# Altium project VCTS_mainboard.PrjPcb (part 1 of 2)
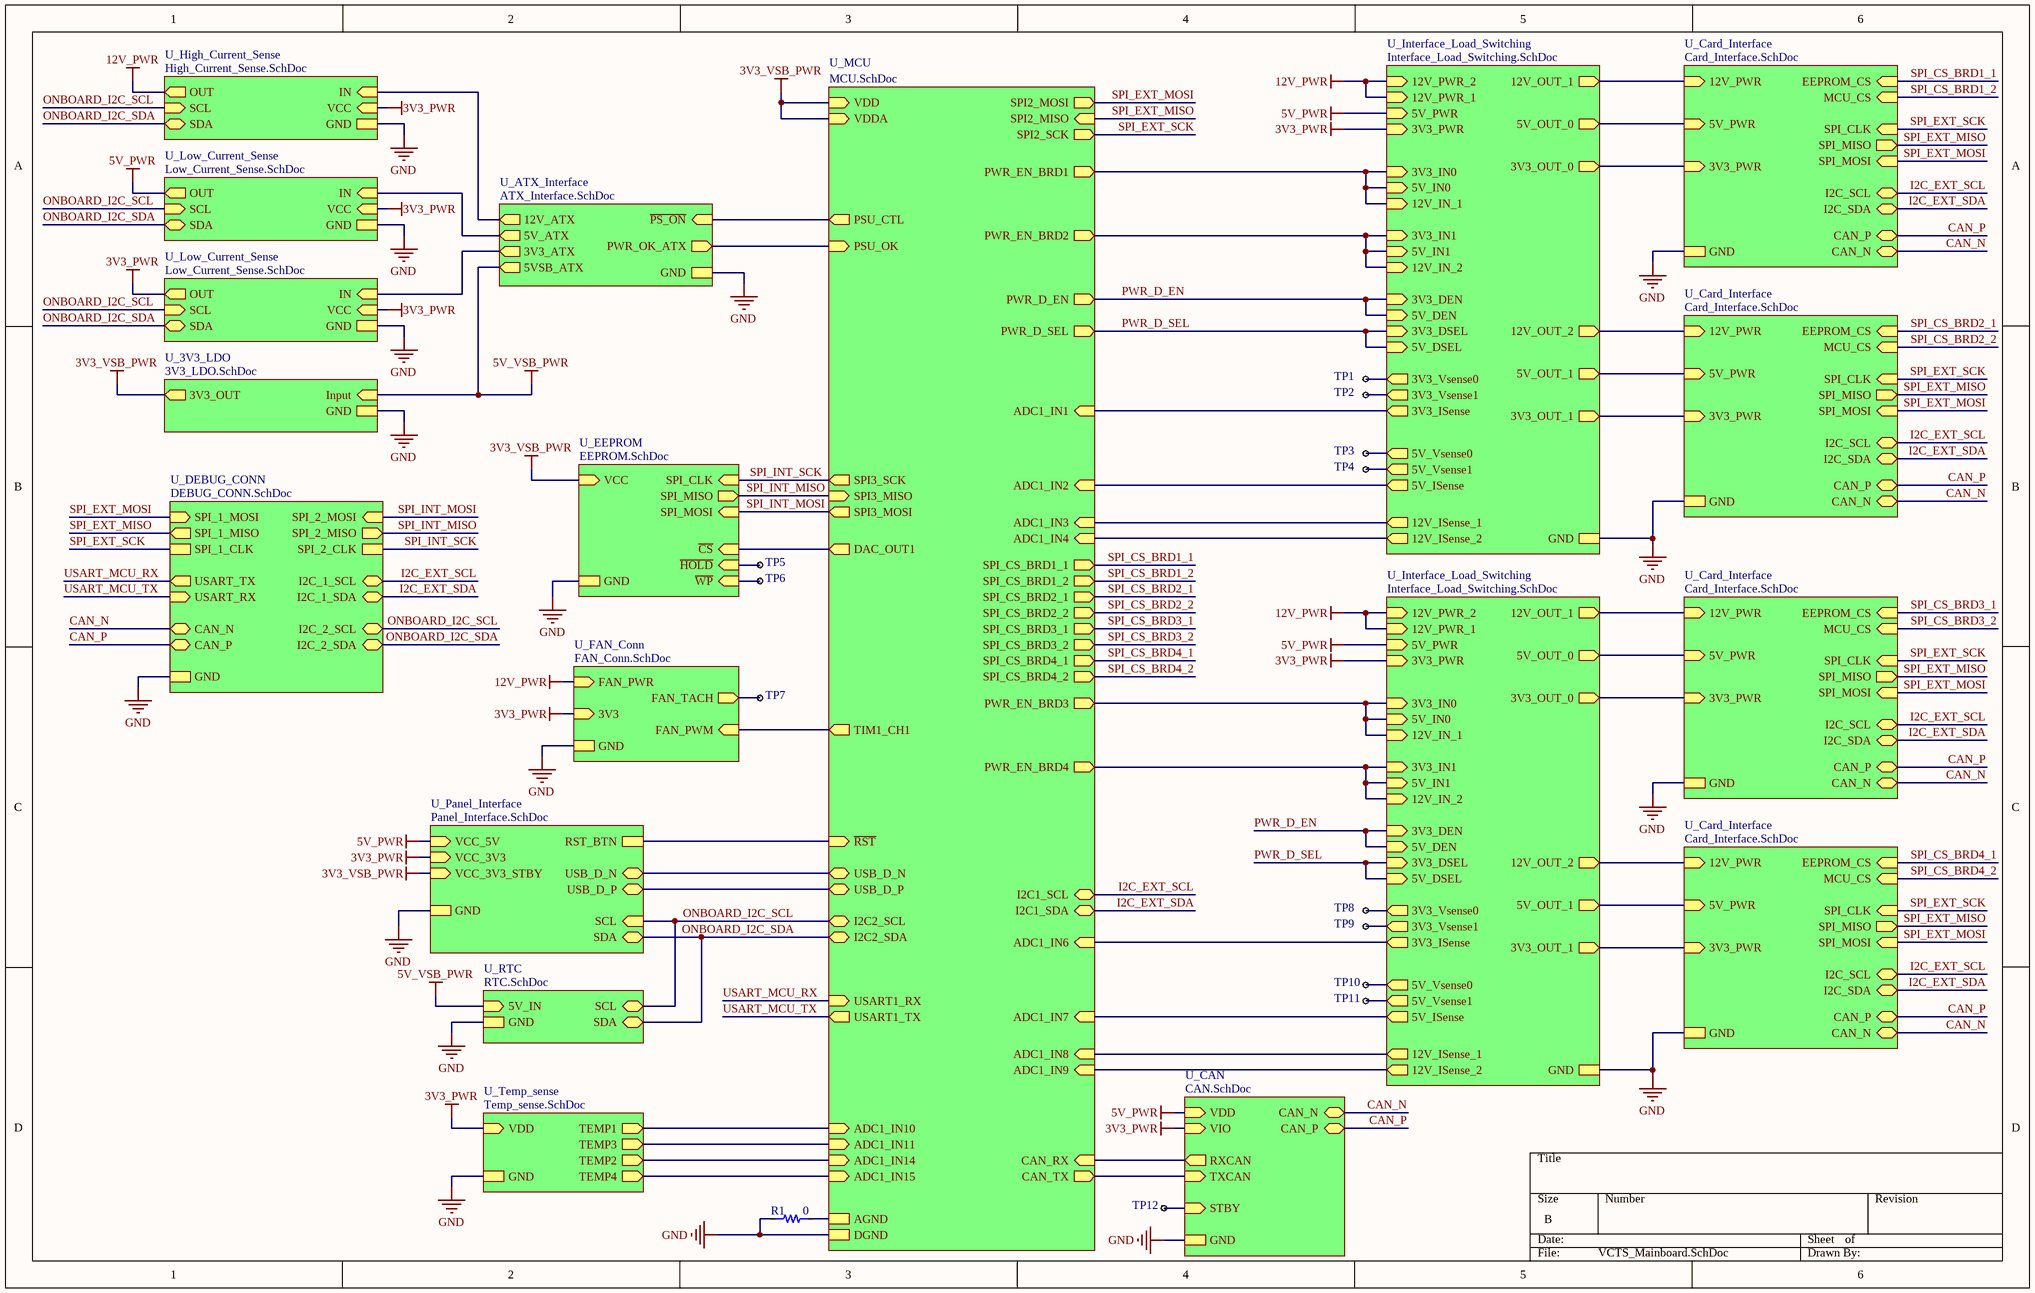
[diagram p0: VCTS_Mainboard.SchDoc]
16 sheets, 546 parts. Net scope: hierarchical (ports join the sheet entries above them; power ports are global).
Board file: VCTS_mainboard.PcbDoc
Sheets:
  VCTS_Mainboard.SchDoc
    U_MCU = MCU.SchDoc
    U_CAN = CAN.SchDoc
    U_RTC = RTC.SchDoc
    U_Temp_sense = Temp_sense.SchDoc
    U_High_Current_Sense = High_Current_Sense.SchDoc
    U_ATX_Interface = ATX_Interface.SchDoc
    U_EEPROM = EEPROM.SchDoc
    U_Card_Interface = Card_Interface.SchDoc
    U_Panel_Interface = Panel_Interface.SchDoc
      U_RGB_LED = RGB_LED.SchDoc
      U_RGB_LED = RGB_LED.SchDoc
      U_RGB_LED = RGB_LED.SchDoc
      U_RGB_LED = RGB_LED.SchDoc
      U_RGB_LED = RGB_LED.SchDoc
      U_RGB_LED = RGB_LED.SchDoc
      U_RGB_LED = RGB_LED.SchDoc
      U_RGB_LED = RGB_LED.SchDoc
    U_FAN_Conn = FAN_Conn.SchDoc
    U_Interface_Load_Switching = Interface_Load_Switching.SchDoc
    U_3V3_LDO = 3V3_LDO.SchDoc
    U_Low_Current_Sense = Low_Current_Sense.SchDoc
    U_Low_Current_Sense = Low_Current_Sense.SchDoc
    U_Card_Interface = Card_Interface.SchDoc
    U_Card_Interface = Card_Interface.SchDoc
    U_Interface_Load_Switching = Interface_Load_Switching.SchDoc
    U_Card_Interface = Card_Interface.SchDoc
    U_DEBUG_CONN = DEBUG_CONN.SchDoc

## Sheet VCTS_Mainboard.SchDoc
size B; SheetNumber: 1; SheetTotal: 16

### Parts
R1  value 0  [0603_RES]  (hidden comment: Resistor)
TP1  1mm Testpoint  [1mm_testpoint]  (value not drawn)
TP2  1mm Testpoint  [1mm_testpoint]  (value not drawn)
TP3  1mm Testpoint  [1mm_testpoint]  (value not drawn)
TP4  1mm Testpoint  [1mm_testpoint]  (value not drawn)
TP5  1mm Testpoint  [1mm_testpoint]  (value not drawn)
TP6  1mm Testpoint  [1mm_testpoint]  (value not drawn)
TP7  1mm Testpoint  [1mm_testpoint]  (value not drawn)
TP8  1mm Testpoint  [1mm_testpoint]  (value not drawn)
TP9  1mm Testpoint  [1mm_testpoint]  (value not drawn)
TP10  1mm Testpoint  [1mm_testpoint]  (value not drawn)
TP11  1mm Testpoint  [1mm_testpoint]  (value not drawn)
TP12  1mm Testpoint  [1mm_testpoint]  (value not drawn)

### Sub-sheets
U_3V3_LDO = 3V3_LDO.SchDoc: Input (in), GND, 3V3_OUT (out)
U_ATX_Interface = ATX_Interface.SchDoc: 12V_ATX (out), 5V_ATX (out), 5VSB_ATX (out), 3V3_ATX (out), PWR_OK_ATX (out), ~{PS_ON} (in), GND
U_CAN = CAN.SchDoc: GND, CAN_N (bidir), CAN_P (bidir), TXCAN (in), RXCAN (out), VDD (in), VIO (in), STBY (in)
U_Card_Interface = Card_Interface.SchDoc: 12V_PWR (in), 5V_PWR (in), 3V3_PWR (in), GND, EEPROM_CS (in), MCU_CS (in), I2C_SDA (bidir), I2C_SCL (bidir), SPI_CLK (in), SPI_MOSI (in), SPI_MISO (out), CAN_P (bidir), CAN_N (bidir)
U_Card_Interface = Card_Interface.SchDoc: 12V_PWR (in), 5V_PWR (in), 3V3_PWR (in), GND, EEPROM_CS (in), MCU_CS (in), I2C_SDA (bidir), I2C_SCL (bidir), SPI_CLK (in), SPI_MOSI (in), SPI_MISO (out), CAN_P (bidir), CAN_N (bidir)
U_Card_Interface = Card_Interface.SchDoc: 12V_PWR (in), 5V_PWR (in), 3V3_PWR (in), GND, EEPROM_CS (in), MCU_CS (in), I2C_SDA (bidir), I2C_SCL (bidir), SPI_CLK (in), SPI_MOSI (in), SPI_MISO (out), CAN_P (bidir), CAN_N (bidir)
U_Card_Interface = Card_Interface.SchDoc: 12V_PWR (in), 5V_PWR (in), 3V3_PWR (in), GND, EEPROM_CS (in), MCU_CS (in), I2C_SDA (bidir), I2C_SCL (bidir), SPI_CLK (in), SPI_MOSI (in), SPI_MISO (out), CAN_P (bidir), CAN_N (bidir)
U_DEBUG_CONN = DEBUG_CONN.SchDoc: SPI_1_MOSI (in), SPI_1_MISO (out), SPI_1_CLK, I2C_2_SCL (bidir), I2C_2_SDA (bidir), SPI_2_MISO (out), GND, SPI_2_MOSI (in), SPI_2_CLK, USART_RX (in), USART_TX (out), CAN_N (bidir), CAN_P (bidir), I2C_1_SCL (bidir), I2C_1_SDA (bidir)
U_EEPROM = EEPROM.SchDoc: ~{CS} (in), ~{HOLD} (in), ~{WP} (in), VCC (in), GND, SPI_MISO (out), SPI_MOSI (in), SPI_CLK (in)
U_FAN_Conn = FAN_Conn.SchDoc: FAN_PWR (in), GND, FAN_PWM (in), FAN_TACH (out), 3V3 (in)
U_High_Current_Sense = High_Current_Sense.SchDoc: VCC (in), SCL (in), SDA (bidir), IN (in), OUT (out), GND
U_Interface_Load_Switching = Interface_Load_Switching.SchDoc: 5V_IN0 (in), 5V_DEN (in), 5V_DSEL (in), 5V_IN1 (in), GND, 5V_OUT_1 (out), 5V_PWR (in), 5V_OUT_0 (out), 3V3_IN0 (in), 3V3_DEN (in), 3V3_DSEL (in), 3V3_IN1 (in), 3V3_OUT_1 (out), 3V3_PWR (in), 3V3_OUT_0 (out), 12V_PWR_1 (in), 12V_IN_1 (in), 12V_OUT_1 (out), 12V_PWR_2 (in), 12V_IN_2 (in), 12V_OUT_2 (out), 5V_ISense (out), 5V_Vsense0 (out), 5V_Vsense1 (out), 3V3_ISense (out), 3V3_Vsense0 (out), 3V3_Vsense1 (out), 12V_ISense_1 (out), 12V_ISense_2 (out)
U_Interface_Load_Switching = Interface_Load_Switching.SchDoc: 5V_IN0 (in), 5V_DEN (in), 5V_DSEL (in), 5V_IN1 (in), GND, 5V_OUT_1 (out), 5V_PWR (in), 5V_OUT_0 (out), 3V3_IN0 (in), 3V3_DEN (in), 3V3_DSEL (in), 3V3_IN1 (in), 3V3_OUT_1 (out), 3V3_PWR (in), 3V3_OUT_0 (out), 12V_PWR_1 (in), 12V_IN_1 (in), 12V_OUT_1 (out), 12V_PWR_2 (in), 12V_IN_2 (in), 12V_OUT_2 (out), 5V_ISense (out), 5V_Vsense0 (out), 5V_Vsense1 (out), 3V3_ISense (out), 3V3_Vsense0 (out), 3V3_Vsense1 (out), 12V_ISense_1 (out), 12V_ISense_2 (out)
U_Low_Current_Sense = Low_Current_Sense.SchDoc: VCC (in), SCL (in), SDA (bidir), IN (in), OUT (out), GND
U_Low_Current_Sense = Low_Current_Sense.SchDoc: VCC (in), SCL (in), SDA (bidir), IN (in), OUT (out), GND
U_MCU = MCU.SchDoc: SPI3_MISO (in), USART1_RX (in), VDD (in), VDDA (in), ADC1_IN1 (in), ADC1_IN2 (in), ADC1_IN3 (in), ADC1_IN4 (in), ADC1_IN6 (in), ADC1_IN7 (in), ADC1_IN8 (in), ADC1_IN9 (in), PWR_EN_BRD1 (out), PWR_EN_BRD2 (out), PWR_EN_BRD3 (out), PWR_EN_BRD4 (out), PWR_D_EN (out), PWR_D_SEL (out), SPI3_MOSI (out), SPI3_SCK (out), CAN_TX (out), USART1_TX (out), CAN_RX (in), SPI_CS_BRD2_1 (out), SPI_CS_BRD2_2 (out), SPI_CS_BRD3_1 (out), SPI_CS_BRD3_2 (out), SPI_CS_BRD4_1 (out), SPI_CS_BRD4_2 (out), ~{RST} (in), I2C2_SCL (bidir), I2C2_SDA (bidir), TIM1_CH1 (out), DAC_OUT1 (out), ADC1_IN10 (in), ADC1_IN15 (in), ADC1_IN11 (in), ADC1_IN14 (in), USB_D_P (bidir), USB_D_N (bidir), PSU_OK (in), PSU_CTL (out), SPI2_MOSI (out), SPI2_SCK (out), SPI2_MISO (in), AGND, DGND, I2C1_SDA (bidir), I2C1_SCL (bidir), SPI_CS_BRD1_1 (out), SPI_CS_BRD1_2 (out)
U_Panel_Interface = Panel_Interface.SchDoc: SDA (bidir), SCL (in), RST_BTN, VCC_3V3_STBY (in), VCC_3V3 (in), USB_D_N (bidir), USB_D_P (bidir), VCC_5V (in), GND
U_RTC = RTC.SchDoc: 5V_IN (in), SCL (bidir), SDA (bidir), GND
U_Temp_sense = Temp_sense.SchDoc: VDD (in), GND, TEMP1 (out), TEMP3 (out), TEMP2 (out), TEMP4 (out)

### Nets
3V3_PWR: sheet U_CAN/VIO, sheet U_Temp_sense/VDD, sheet U_High_Current_Sense/VCC, sheet U_Panel_Interface/VCC_3V3, sheet U_FAN_Conn/3V3, sheet U_Interface_Load_Switching/3V3_PWR, sheet U_Low_Current_Sense/VCC, sheet U_Low_Current_Sense/VCC, sheet U_Low_Current_Sense/OUT, sheet U_Interface_Load_Switching/3V3_PWR
3V3_VSB_PWR: sheet U_MCU/VDD, sheet U_MCU/VDDA, sheet U_EEPROM/VCC, sheet U_Panel_Interface/VCC_3V3_STBY, sheet U_3V3_LDO/3V3_OUT  [project net VCC]
5V_PWR: sheet U_CAN/VDD, sheet U_Panel_Interface/VCC_5V, sheet U_Interface_Load_Switching/5V_PWR, sheet U_Low_Current_Sense/OUT, sheet U_Interface_Load_Switching/5V_PWR  [project net VCC_5V]
5V_VSB_PWR: sheet U_RTC/5V_IN, sheet U_ATX_Interface/5VSB_ATX, sheet U_3V3_LDO/Input  [project net 5VSB_ATX]
12V_PWR: sheet U_High_Current_Sense/OUT, sheet U_FAN_Conn/FAN_PWR, sheet U_Interface_Load_Switching/12V_PWR_1, sheet U_Interface_Load_Switching/12V_PWR_2, sheet U_Interface_Load_Switching/12V_PWR_1, sheet U_Interface_Load_Switching/12V_PWR_2
GND: R1.1 ; sheet U_MCU/DGND, sheet U_CAN/GND, sheet U_RTC/GND, sheet U_Temp_sense/GND, sheet U_High_Current_Sense/GND, sheet U_ATX_Interface/GND, sheet U_EEPROM/GND, sheet U_Card_Interface/GND, sheet U_Panel_Interface/GND, sheet U_FAN_Conn/GND, sheet U_Interface_Load_Switching/GND, sheet U_3V3_LDO/GND, sheet U_Low_Current_Sense/GND, sheet U_Low_Current_Sense/GND, sheet U_Card_Interface/GND, sheet U_Card_Interface/GND, sheet U_Interface_Load_Switching/GND, sheet U_Card_Interface/GND, sheet U_DEBUG_CONN/GND  [project net DGND]
3V3_ATX: sheet U_ATX_Interface/3V3_ATX, sheet U_Low_Current_Sense/IN
3V3_ISense: sheet U_MCU/ADC1_IN1, sheet U_Interface_Load_Switching/3V3_ISense
3V3_ISense: sheet U_MCU/ADC1_IN6, sheet U_Interface_Load_Switching/3V3_ISense  [a separate net that carries the same name]
3V3_OUT_0: sheet U_Card_Interface/3V3_PWR, sheet U_Interface_Load_Switching/3V3_OUT_0
3V3_OUT_0: sheet U_Card_Interface/3V3_PWR, sheet U_Interface_Load_Switching/3V3_OUT_0  [a separate net that carries the same name]
3V3_OUT_1: sheet U_Interface_Load_Switching/3V3_OUT_1, sheet U_Card_Interface/3V3_PWR
3V3_OUT_1: sheet U_Interface_Load_Switching/3V3_OUT_1, sheet U_Card_Interface/3V3_PWR  [a separate net that carries the same name]
3V3_Vsense0: TP1.1 ; sheet U_Interface_Load_Switching/3V3_Vsense0
3V3_Vsense0: TP8.1 ; sheet U_Interface_Load_Switching/3V3_Vsense0  [a separate net that carries the same name]
3V3_Vsense1: TP2.1 ; sheet U_Interface_Load_Switching/3V3_Vsense1
3V3_Vsense1: TP9.1 ; sheet U_Interface_Load_Switching/3V3_Vsense1  [a separate net that carries the same name]
5V_ATX: sheet U_ATX_Interface/5V_ATX, sheet U_Low_Current_Sense/IN
5V_ISense: sheet U_MCU/ADC1_IN2, sheet U_Interface_Load_Switching/5V_ISense
5V_ISense: sheet U_MCU/ADC1_IN7, sheet U_Interface_Load_Switching/5V_ISense  [a separate net that carries the same name]
5V_OUT_0: sheet U_Card_Interface/5V_PWR, sheet U_Interface_Load_Switching/5V_OUT_0
5V_OUT_0: sheet U_Card_Interface/5V_PWR, sheet U_Interface_Load_Switching/5V_OUT_0  [a separate net that carries the same name]
5V_OUT_1: sheet U_Interface_Load_Switching/5V_OUT_1, sheet U_Card_Interface/5V_PWR
5V_OUT_1: sheet U_Interface_Load_Switching/5V_OUT_1, sheet U_Card_Interface/5V_PWR  [a separate net that carries the same name]
5V_Vsense0: TP3.1 ; sheet U_Interface_Load_Switching/5V_Vsense0
5V_Vsense0: TP10.1 ; sheet U_Interface_Load_Switching/5V_Vsense0  [a separate net that carries the same name]
5V_Vsense1: TP4.1 ; sheet U_Interface_Load_Switching/5V_Vsense1
5V_Vsense1: TP11.1 ; sheet U_Interface_Load_Switching/5V_Vsense1  [a separate net that carries the same name]
12V_ATX: sheet U_High_Current_Sense/IN, sheet U_ATX_Interface/12V_ATX
12V_IN_1: sheet U_MCU/PWR_EN_BRD1, sheet U_Interface_Load_Switching/5V_IN0, sheet U_Interface_Load_Switching/3V3_IN0, sheet U_Interface_Load_Switching/12V_IN_1
12V_IN_1: sheet U_MCU/PWR_EN_BRD3, sheet U_Interface_Load_Switching/5V_IN0, sheet U_Interface_Load_Switching/3V3_IN0, sheet U_Interface_Load_Switching/12V_IN_1  [a separate net that carries the same name]
12V_IN_2: sheet U_MCU/PWR_EN_BRD2, sheet U_Interface_Load_Switching/5V_IN1, sheet U_Interface_Load_Switching/3V3_IN1, sheet U_Interface_Load_Switching/12V_IN_2
12V_IN_2: sheet U_MCU/PWR_EN_BRD4, sheet U_Interface_Load_Switching/5V_IN1, sheet U_Interface_Load_Switching/3V3_IN1, sheet U_Interface_Load_Switching/12V_IN_2  [a separate net that carries the same name]
12V_ISense_1: sheet U_MCU/ADC1_IN3, sheet U_Interface_Load_Switching/12V_ISense_1
12V_ISense_1: sheet U_MCU/ADC1_IN8, sheet U_Interface_Load_Switching/12V_ISense_1  [a separate net that carries the same name]
12V_ISense_2: sheet U_MCU/ADC1_IN4, sheet U_Interface_Load_Switching/12V_ISense_2
12V_ISense_2: sheet U_MCU/ADC1_IN9, sheet U_Interface_Load_Switching/12V_ISense_2  [a separate net that carries the same name]
12V_OUT_1: sheet U_Card_Interface/12V_PWR, sheet U_Interface_Load_Switching/12V_OUT_1
12V_OUT_1: sheet U_Card_Interface/12V_PWR, sheet U_Interface_Load_Switching/12V_OUT_1  [a separate net that carries the same name]
12V_OUT_2: sheet U_Interface_Load_Switching/12V_OUT_2, sheet U_Card_Interface/12V_PWR
12V_OUT_2: sheet U_Interface_Load_Switching/12V_OUT_2, sheet U_Card_Interface/12V_PWR  [a separate net that carries the same name]
ADC1_IN10: sheet U_MCU/ADC1_IN10, sheet U_Temp_sense/TEMP1
ADC1_IN11: sheet U_MCU/ADC1_IN11, sheet U_Temp_sense/TEMP3
ADC1_IN14: sheet U_MCU/ADC1_IN14, sheet U_Temp_sense/TEMP2
ADC1_IN15: sheet U_MCU/ADC1_IN15, sheet U_Temp_sense/TEMP4
AGND: R1.2 ; sheet U_MCU/AGND
CAN_N: sheet U_CAN/CAN_N, sheet U_Card_Interface/CAN_N, sheet U_Card_Interface/CAN_N, sheet U_Card_Interface/CAN_N, sheet U_Card_Interface/CAN_N, sheet U_DEBUG_CONN/CAN_N
CAN_P: sheet U_CAN/CAN_P, sheet U_Card_Interface/CAN_P, sheet U_Card_Interface/CAN_P, sheet U_Card_Interface/CAN_P, sheet U_Card_Interface/CAN_P, sheet U_DEBUG_CONN/CAN_P
CAN_RX: sheet U_MCU/CAN_RX, sheet U_CAN/RXCAN
CAN_TX: sheet U_MCU/CAN_TX, sheet U_CAN/TXCAN
EEPROM_CS: sheet U_MCU/DAC_OUT1, sheet U_EEPROM/~{CS}
EEPROM_HOLD: TP5.1 ; sheet U_EEPROM/~{HOLD}
EEPROM_WP: TP6.1 ; sheet U_EEPROM/~{WP}
FAN_PWM: sheet U_MCU/TIM1_CH1, sheet U_FAN_Conn/FAN_PWM
FAN_TACH: TP7.1 ; sheet U_FAN_Conn/FAN_TACH
I2C_EXT_SCL: sheet U_MCU/I2C1_SCL, sheet U_Card_Interface/I2C_SCL, sheet U_Card_Interface/I2C_SCL, sheet U_Card_Interface/I2C_SCL, sheet U_Card_Interface/I2C_SCL, sheet U_DEBUG_CONN/I2C_1_SCL
I2C_EXT_SDA: sheet U_MCU/I2C1_SDA, sheet U_Card_Interface/I2C_SDA, sheet U_Card_Interface/I2C_SDA, sheet U_Card_Interface/I2C_SDA, sheet U_Card_Interface/I2C_SDA, sheet U_DEBUG_CONN/I2C_1_SDA
ONBOARD_I2C_SCL: sheet U_MCU/I2C2_SCL, sheet U_RTC/SCL, sheet U_High_Current_Sense/SCL, sheet U_Panel_Interface/SCL, sheet U_Low_Current_Sense/SCL, sheet U_Low_Current_Sense/SCL, sheet U_DEBUG_CONN/I2C_2_SCL
ONBOARD_I2C_SDA: sheet U_MCU/I2C2_SDA, sheet U_RTC/SDA, sheet U_High_Current_Sense/SDA, sheet U_Panel_Interface/SDA, sheet U_Low_Current_Sense/SDA, sheet U_Low_Current_Sense/SDA, sheet U_DEBUG_CONN/I2C_2_SDA
~{PS_ON}: sheet U_MCU/PSU_CTL, sheet U_ATX_Interface/~{PS_ON}
PWR_D_EN: sheet U_MCU/PWR_D_EN, sheet U_Interface_Load_Switching/5V_DEN, sheet U_Interface_Load_Switching/3V3_DEN, sheet U_Interface_Load_Switching/5V_DEN, sheet U_Interface_Load_Switching/3V3_DEN
PWR_D_SEL: sheet U_MCU/PWR_D_SEL, sheet U_Interface_Load_Switching/5V_DSEL, sheet U_Interface_Load_Switching/3V3_DSEL, sheet U_Interface_Load_Switching/5V_DSEL, sheet U_Interface_Load_Switching/3V3_DSEL
PWR_OK_ATX: sheet U_MCU/PSU_OK, sheet U_ATX_Interface/PWR_OK_ATX
~{RST}: sheet U_MCU/~{RST}, sheet U_Panel_Interface/RST_BTN
SPI_CS_BRD1_1: sheet U_MCU/SPI_CS_BRD1_1, sheet U_Card_Interface/EEPROM_CS
SPI_CS_BRD1_2: sheet U_MCU/SPI_CS_BRD1_2, sheet U_Card_Interface/MCU_CS
SPI_CS_BRD2_1: sheet U_MCU/SPI_CS_BRD2_1, sheet U_Card_Interface/EEPROM_CS
SPI_CS_BRD2_2: sheet U_MCU/SPI_CS_BRD2_2, sheet U_Card_Interface/MCU_CS
SPI_CS_BRD3_1: sheet U_MCU/SPI_CS_BRD3_1, sheet U_Card_Interface/EEPROM_CS
SPI_CS_BRD3_2: sheet U_MCU/SPI_CS_BRD3_2, sheet U_Card_Interface/MCU_CS
SPI_CS_BRD4_1: sheet U_MCU/SPI_CS_BRD4_1, sheet U_Card_Interface/EEPROM_CS
SPI_CS_BRD4_2: sheet U_MCU/SPI_CS_BRD4_2, sheet U_Card_Interface/MCU_CS
SPI_EXT_MISO: sheet U_MCU/SPI2_MISO, sheet U_Card_Interface/SPI_MISO, sheet U_Card_Interface/SPI_MISO, sheet U_Card_Interface/SPI_MISO, sheet U_Card_Interface/SPI_MISO, sheet U_DEBUG_CONN/SPI_1_MISO
SPI_EXT_MOSI: sheet U_MCU/SPI2_MOSI, sheet U_Card_Interface/SPI_MOSI, sheet U_Card_Interface/SPI_MOSI, sheet U_Card_Interface/SPI_MOSI, sheet U_Card_Interface/SPI_MOSI, sheet U_DEBUG_CONN/SPI_1_MOSI
SPI_EXT_SCK: sheet U_MCU/SPI2_SCK, sheet U_Card_Interface/SPI_CLK, sheet U_Card_Interface/SPI_CLK, sheet U_Card_Interface/SPI_CLK, sheet U_Card_Interface/SPI_CLK, sheet U_DEBUG_CONN/SPI_1_CLK
SPI_INT_MISO: sheet U_MCU/SPI3_MISO, sheet U_EEPROM/SPI_MISO, sheet U_DEBUG_CONN/SPI_2_MISO
SPI_INT_MOSI: sheet U_MCU/SPI3_MOSI, sheet U_EEPROM/SPI_MOSI, sheet U_DEBUG_CONN/SPI_2_MOSI
SPI_INT_SCK: sheet U_MCU/SPI3_SCK, sheet U_EEPROM/SPI_CLK, sheet U_DEBUG_CONN/SPI_2_CLK
STBY: TP12.1 ; sheet U_CAN/STBY
USART_MCU_RX: sheet U_MCU/USART1_RX, sheet U_DEBUG_CONN/USART_TX
USART_MCU_TX: sheet U_MCU/USART1_TX, sheet U_DEBUG_CONN/USART_RX
USB_D_N: sheet U_MCU/USB_D_N, sheet U_Panel_Interface/USB_D_N
USB_D_P: sheet U_MCU/USB_D_P, sheet U_Panel_Interface/USB_D_P

### Library data of the parts
TP1-TP12 = 1mm Testpoint: 1mm test point; ComponentLink1Description: Digikey; ComponentLink1URL: https://www.digikey.com/product-detail/en/te-connectivity-amp-connectors/RCU-0C/A106145CT-ND/3477802
R1 = Resistor: Tolerance: *

## Sheet MCU.SchDoc
size A; SheetNumber: 3; SheetTotal: 16
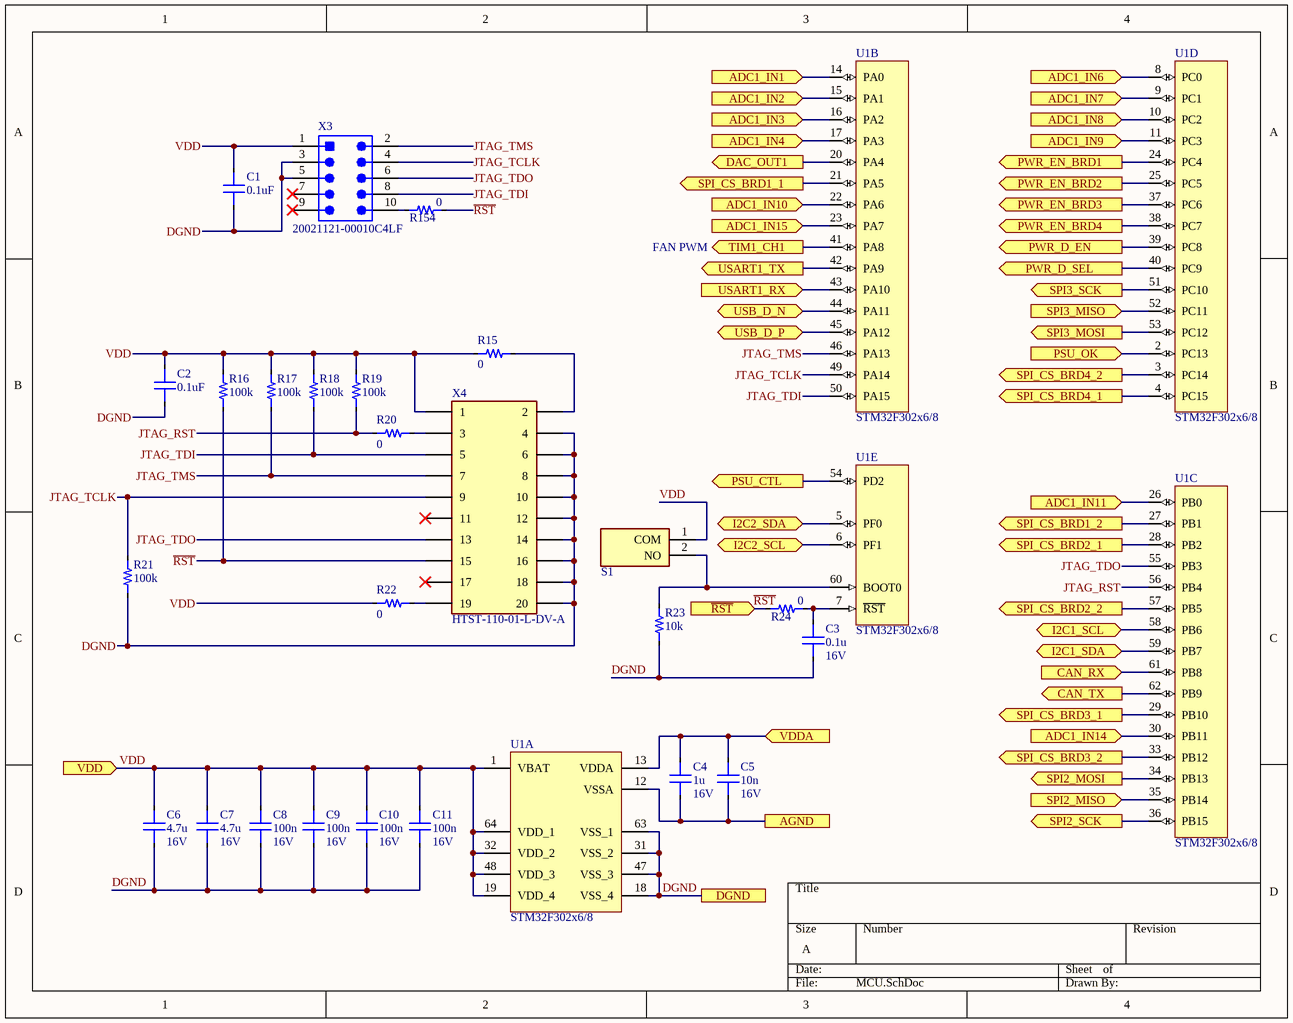
[diagram p1: MCU.SchDoc]

### Parts
C1  value 0.1uF  [0603_CAP]  (hidden comment: Capacitor)
C2  value 0.1uF  [0603_CAP]  (hidden comment: Capacitor)
C3  value 0.1u  Voltage: 16V  [0603_CAP]  (hidden comment: Capacitor)
C4  value 1u  Voltage: 16V  [0603_CAP]  (hidden comment: Capacitor)
C5  value 10n  Voltage: 16V  [0603_CAP]  (hidden comment: Capacitor)
C6  value 4.7u  Voltage: 16V  [0805_CAP]  (hidden comment: Capacitor)
C7  value 4.7u  Voltage: 16V  [0805_CAP]  (hidden comment: Capacitor)
C8  value 100n  Voltage: 16V  [0603_CAP]  (hidden comment: Capacitor)
C9  value 100n  Voltage: 16V  [0603_CAP]  (hidden comment: Capacitor)
C10  value 100n  Voltage: 16V  [0603_CAP]  (hidden comment: Capacitor)
C11  value 100n  Voltage: 16V  [0603_CAP]  (hidden comment: Capacitor)
R15  value 0  [0603_RES]  (hidden comment: Resistor)
R16  value 100k  [0603_RES]  (hidden comment: Resistor)
R17  value 100k  [0603_RES]  (hidden comment: Resistor)
R18  value 100k  [0603_RES]  (hidden comment: Resistor)
R19  value 100k  [0603_RES]  (hidden comment: Resistor)
R20  value 0  [0603_RES]  (hidden comment: Resistor)
R21  value 100k  [0603_RES]  (hidden comment: Resistor)
R22  value 0  [0603_RES]  (hidden comment: Resistor)
R23  value 10k  [0603_RES]  (hidden comment: Resistor)
R24  value 0  [0603_RES]  (hidden comment: Resistor)
R154  value 0  [0603_RES]  (hidden comment: Resistor)
S1  DS04-254-2-01BK-SMT-TR  [DS04254201BKSMTTR]  (value not drawn)
U1  STM32F302x6/8  [LQFP 10mm x 10mm]  (parts A,B,C,D,E of 5)
X3  20021121-00010C4LF  [HDR2X5_SMT]
X4  HTST-110-01-L-DV-A  [HTSS-110-01-L-DV]

### Ports
ADC1_IN1 (in), ADC1_IN2 (in), ADC1_IN3 (in), ADC1_IN4 (in), ADC1_IN6 (in), ADC1_IN7 (in), ADC1_IN8 (in), ADC1_IN9 (in), ADC1_IN10 (in), ADC1_IN11 (in), ADC1_IN14 (in), ADC1_IN15 (in), AGND, CAN_RX (in), CAN_TX (out), DAC_OUT1 (out), DGND, I2C1_SCL (bidir), I2C1_SDA (bidir), I2C2_SCL (bidir), I2C2_SDA (bidir), PSU_CTL (out), PSU_OK (in), PWR_D_EN (out), PWR_D_SEL (out), PWR_EN_BRD1 (out), PWR_EN_BRD2 (out), PWR_EN_BRD3 (out), PWR_EN_BRD4 (out), SPI2_MISO (in), SPI2_MOSI (out), SPI2_SCK (out), SPI3_MISO (in), SPI3_MOSI (out), SPI3_SCK (out), SPI_CS_BRD1_1 (out), SPI_CS_BRD1_2 (out), SPI_CS_BRD2_1 (out), SPI_CS_BRD2_2 (out), SPI_CS_BRD3_1 (out), SPI_CS_BRD3_2 (out), SPI_CS_BRD4_1 (out), SPI_CS_BRD4_2 (out), TIM1_CH1 (out), USART1_RX (in), USART1_TX (out), USB_D_N (bidir), USB_D_P (bidir), VDD (in), VDDA (in), ~{RST} (in)

### Nets
DGND: C1.1 C2.1 C3.1 C6.1 C7.1 C8.1 C9.1 C10.1 C11.1 R21.1 R23.1 U1.18(VSS_4) U1.31(VSS_2) U1.47(VSS_3) U1.63(VSS_1) X3.3 X3.5 X4.04(4) X4.06(6) X4.08(8) X4.10 X4.12 X4.14 X4.16 X4.18 X4.20 ; port DGND
VDD: C1.2 C2.2 C4.2 C5.2 C6.2 C7.2 C8.2 C9.2 C10.2 C11.2 R15.1 R16.2 R17.2 R18.2 R19.2 R22.1 S1.1(COM) U1.1(VBAT) U1.13(VDDA) U1.19(VDD_4) U1.32(VDD_2) U1.48(VDD_3) U1.64(VDD_1) X3.1 X4.01(1) ; port VDD, port VDDA  [project net VCC]
3V3_ISense: U1.14(PA0) ; port ADC1_IN1
3V3_ISense: U1.8(PC0) ; port ADC1_IN6  [a separate net that carries the same name]
5V_ISense: U1.15(PA1) ; port ADC1_IN2
5V_ISense: U1.9(PC1) ; port ADC1_IN7  [a separate net that carries the same name]
12V_IN_1: U1.24(PC4) ; port PWR_EN_BRD1
12V_IN_1: U1.37(PC6) ; port PWR_EN_BRD3  [a separate net that carries the same name]
12V_IN_2: U1.25(PC5) ; port PWR_EN_BRD2
12V_IN_2: U1.38(PC7) ; port PWR_EN_BRD4  [a separate net that carries the same name]
12V_ISense_1: U1.16(PA2) ; port ADC1_IN3
12V_ISense_1: U1.10(PC2) ; port ADC1_IN8  [a separate net that carries the same name]
12V_ISense_2: U1.17(PA3) ; port ADC1_IN4
12V_ISense_2: U1.11(PC3) ; port ADC1_IN9  [a separate net that carries the same name]
ADC1_IN10: U1.22(PA6) ; port ADC1_IN10
ADC1_IN11: U1.26(PB0) ; port ADC1_IN11
ADC1_IN14: U1.30(PB11) ; port ADC1_IN14
ADC1_IN15: U1.23(PA7) ; port ADC1_IN15
AGND: C4.1 C5.1 U1.12(VSSA) ; port AGND
CAN_RX: U1.61(PB8) ; port CAN_RX
CAN_TX: U1.62(PB9) ; port CAN_TX
EEPROM_CS: U1.20(PA4) ; port DAC_OUT1
FAN_PWM: U1.41(PA8) ; port TIM1_CH1
I2C_EXT_SCL: U1.58(PB6) ; port I2C1_SCL
I2C_EXT_SDA: U1.59(PB7) ; port I2C1_SDA
JTAG_RST: R19.1 R20.1 U1.56(PB4)
JTAG_TCLK: R21.2 U1.49(PA14) X3.4 X4.09(9)
JTAG_TDI: R18.1 U1.50(PA15) X3.8 X4.05(5)
JTAG_TDO: U1.55(PB3) X3.6 X4.13
JTAG_TMS: R17.1 U1.46(PA13) X3.2 X4.07(7)
ONBOARD_I2C_SCL: U1.6(PF1) ; port I2C2_SCL
ONBOARD_I2C_SDA: U1.5(PF0) ; port I2C2_SDA
~{PS_ON}: U1.54(PD2) ; port PSU_CTL
PWR_D_EN: U1.39(PC8) ; port PWR_D_EN
PWR_D_SEL: U1.40(PC9) ; port PWR_D_SEL
PWR_OK_ATX: U1.2(PC13) ; port PSU_OK
~{RST}: R16.1 R24.1 R154.2 X4.15 ; port ~{RST}
SPI_CS_BRD1_1: U1.21(PA5) ; port SPI_CS_BRD1_1
SPI_CS_BRD1_2: U1.27(PB1) ; port SPI_CS_BRD1_2
SPI_CS_BRD2_1: U1.28(PB2) ; port SPI_CS_BRD2_1
SPI_CS_BRD2_2: U1.57(PB5) ; port SPI_CS_BRD2_2
SPI_CS_BRD3_1: U1.29(PB10) ; port SPI_CS_BRD3_1
SPI_CS_BRD3_2: U1.33(PB12) ; port SPI_CS_BRD3_2
SPI_CS_BRD4_1: U1.4(PC15) ; port SPI_CS_BRD4_1
SPI_CS_BRD4_2: U1.3(PC14) ; port SPI_CS_BRD4_2
SPI_EXT_MISO: U1.35(PB14) ; port SPI2_MISO
SPI_EXT_MOSI: U1.34(PB13) ; port SPI2_MOSI
SPI_EXT_SCK: U1.36(PB15) ; port SPI2_SCK
SPI_INT_MISO: U1.52(PC11) ; port SPI3_MISO
SPI_INT_MOSI: U1.53(PC12) ; port SPI3_MOSI
SPI_INT_SCK: U1.51(PC10) ; port SPI3_SCK
USART_MCU_RX: U1.43(PA10) ; port USART1_RX
USART_MCU_TX: U1.42(PA9) ; port USART1_TX
USB_D_N: U1.44(PA11) ; port USB_D_N
USB_D_P: U1.45(PA12) ; port USB_D_P
NetC3_2: C3.2 R24.2 U1.7(~{RST})
NetR15_2: R15.2 X4.02(2)
NetR20_2: R20.2 X4.03(3)
NetR22_2: R22.2 X4.19
NetR23_2: R23.2 S1.2(NO) U1.60(BOOT0)
NetR154_1: R154.1 X3.10

Not connected (* = marked no-connect by the designer): X3 7* 9*; X4 11* 17*

### Notes on the sheet
- FAN PWM

### Library data of the parts
S1 = DS04-254-2-01BK-SMT-TR: DIP Switches / SIP Switches DIP Switch, SPST, 2.54 pitch, flat actuator, SMT, Tape and reel, 1 position, Black; Manufacturer_Name: CUI Devices; Datasheet Link: https://www.cuidevices.com/product/resource/supplyframepdf/ds04-254-smt.pdf; Height: 4.3mm; Manufacturer_Part_Number: DS04-254-2-01BK-SMT-TR; Mouser Part Number: 490-DS04254201BK-STR; Mouser Price/Stock: https://www.mouser.co.uk/ProductDetail/CUI-Devices/DS04-254-2-01BK-SMT-TR?qs=wnTfsH77Xs4xXRFXKF0ssg%3D%3D; Arrow Part Number: DS04-254-2-01BK-SMT-TR; Arrow Price/Stock: https://www.arrow.com/en/products/ds04-254-2-01bk-smt-tr/cui-devices?region=nac
U1 = STM32F302x6/8: Vcc: 3V3; Package: LQFP64; ComponentLink1Description: ST; ComponentLink1URL: https://www.st.com/en/microcontrollers-microprocessors/stm32f302r8.html
X3 = 20021121-00010C4LF: Header, 10-Leads, Body 3.43x6.35mm, Pitch 1.27mm; Circuits: 10; Name: 20021121-00010C4LF; ComponentLink1Description: Digikey; ComponentLink1URL: https://www.digikey.com/product-detail/en/amphenol-icc-fci/20021121-00010C4LF/609-3695-1-ND/2209147
X4 = HTST-110-01-L-DV-A: Connector Header Surface Mount 20 position 0.100" (2.54mm); MP: SSM-110-F-DV-A; MF: Samtec; Package: None; Price: None; Availability: Unavailable; Value: *; ComponentLink1Description: Samtec Site; ComponentLink1URL: https://www.samtec.com/products/htst-110-01-l-dv-a; ComponentLink2Description: Digikey; ComponentLink2URL: https://www.digikey.com/en/products/detail/samtec-inc/HTST-110-01-L-DV-A/2664196
C1-C11 = Capacitor: Dielectric: *; Percent Tolerance: *; ESR: *
R15-R24 R154 = Resistor: Tolerance: *

## Sheet CAN.SchDoc
size A; SheetNumber: 9; SheetTotal: 16
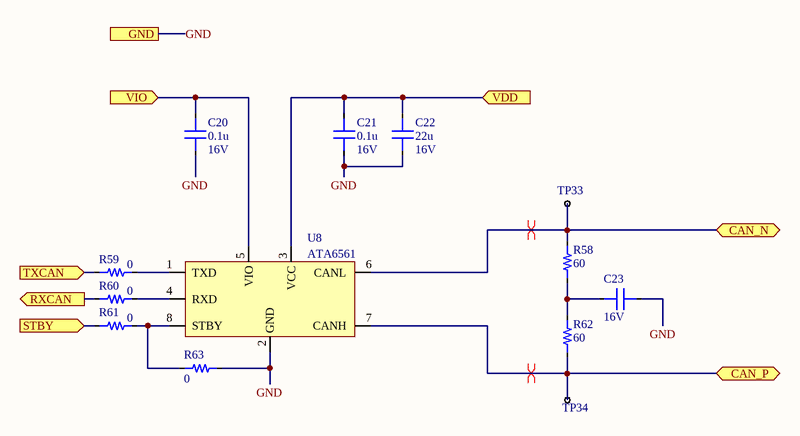
[diagram p2: CAN.SchDoc]

### Parts
C20  value 0.1u  Voltage: 16V  [0603_CAP]  (hidden comment: Capacitor)
C21  value 0.1u  Voltage: 16V  [0603_CAP]  (hidden comment: Capacitor)
C22  value 22u  Voltage: 16V  [0805_CAP]  (hidden comment: Capacitor)
C23  Voltage: 16V  [0603_CAP]  (hidden comment: Capacitor)
R58  value 60  [0603_RES]  (hidden comment: Resistor)
R59  value 0  [0603_RES]  (hidden comment: Resistor)
R60  value 0  [0603_RES]  (hidden comment: Resistor)
R61  value 0  [0603_RES]  (hidden comment: Resistor)
R62  value 60  [0603_RES]  (hidden comment: Resistor)
R63  value 0  [0603_RES]  (hidden comment: Resistor)
TP33  1mm Testpoint  [1mm_testpoint]  (value not drawn)
TP34  1mm Testpoint  [1mm_testpoint]  (value not drawn)
U8  ATA6561  [SOIC-8]

### Ports
CAN_N (bidir), CAN_P (bidir), GND, RXCAN (out), STBY (in), TXCAN (in), VDD (in), VIO (in)

### Nets
3V3_PWR: C20.2 U8.5(VIO) ; port VIO
GND: C20.1 C21.1 C22.1 C23.2 R63.2 U8.2(GND) ; port GND  [project net DGND]
VCC_5V: C21.2 C22.2 U8.3(VCC) ; port VDD
CAN_N: R58.2 TP33.1 U8.6(CANL) ; port CAN_N
CAN_P: R62.1 TP34.1 U8.7(CANH) ; port CAN_P
CAN_RX: R60.1 ; port RXCAN
CAN_TX: R59.1 ; port TXCAN
STBY: R61.1 ; port STBY
NetC23_1: C23.1 R58.1 R62.2
NetR59_2: R59.2 U8.1(TXD)
NetR60_2: R60.2 U8.4(RXD)
NetR61_2: R61.2 R63.1 U8.8(STBY)

### Layout directives
differential pair: CAN_N, CAN_P

### Library data of the parts
TP33 TP34 = 1mm Testpoint: 1mm test point; ComponentLink1Description: Digikey; ComponentLink1URL: https://www.digikey.com/product-detail/en/te-connectivity-amp-connectors/RCU-0C/A106145CT-ND/3477802
U8 = ATA6561: 1/1 Transceiver CANbus 8-SO; Vcc: 5; Name: ATA6561; Type: CAN; ComponentLink1Description: Digikey; ComponentLink1URL: https://www.digikey.com/en/products/detail/microchip-technology/ATA6561-GAQW-N/9453105; ComponentLink2Description: Datasheet; ComponentLink2URL: https://ww1.microchip.com/downloads/en/DeviceDoc/20005991B.pdf
C20-C23 = Capacitor: Dielectric: *; Percent Tolerance: *; ESR: *
R58-R63 = Resistor: Tolerance: *

## Sheet RTC.SchDoc
size A; SheetNumber: 5; SheetTotal: 16
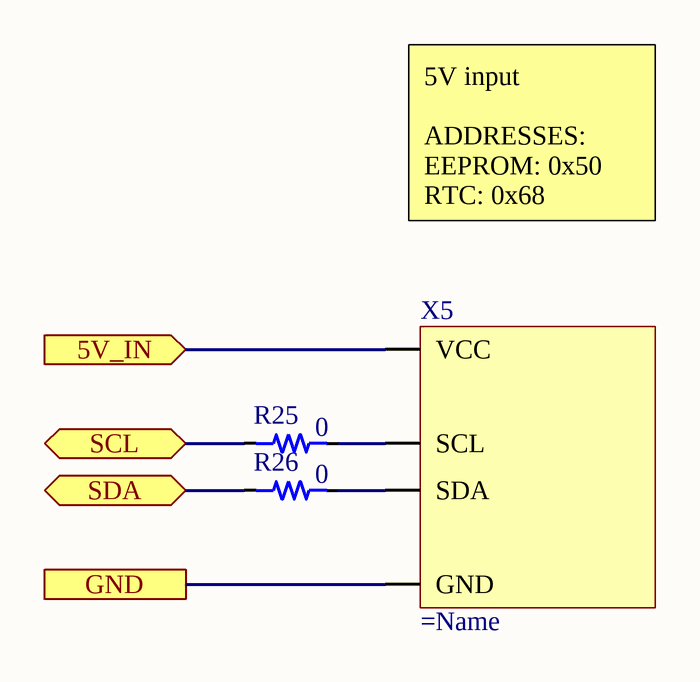
[diagram p3: RTC.SchDoc]

### Parts
R25  value 0  [0603_RES]  (hidden comment: Resistor)
R26  value 0  [0603_RES]  (hidden comment: Resistor)
X5  (no value)  [RTC Module Generic]

### Ports
5V_IN (in), GND, SCL (bidir), SDA (bidir)

### Nets
5VSB_ATX: X5.2(VCC) ; port 5V_IN
DGND: X5.1(GND) ; port GND
ONBOARD_I2C_SCL: R25.1 ; port SCL
ONBOARD_I2C_SDA: R26.1 ; port SDA
NetR25_2: R25.2 X5.4(SCL)
NetR26_2: R26.2 X5.3(SDA)

### Notes on the sheet
- 5V input
  ADDRESSES:
  EEPROM: 0x50
  RTC: 0x68

### Library data of the parts
X5 = RTC Module: Generic RTC module with DS3231 and AT24C32
R25 R26 = Resistor: Tolerance: *

## Sheet Temp_sense.SchDoc
size A; SheetNumber: 4; SheetTotal: 16
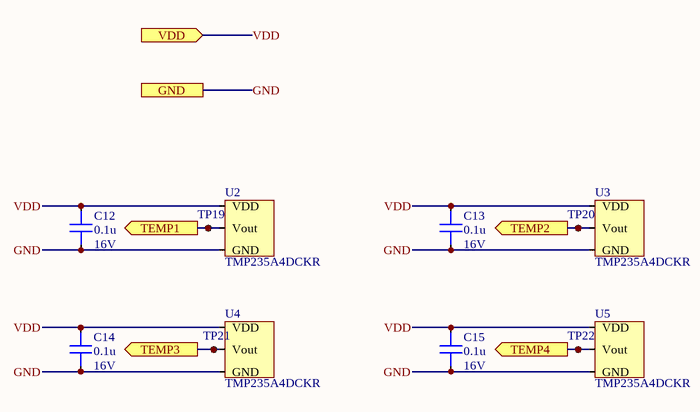
[diagram p4: Temp_sense.SchDoc]

### Parts
C12  value 0.1u  Voltage: 16V  [0603_CAP]  (hidden comment: Capacitor)
C13  value 0.1u  Voltage: 16V  [0603_CAP]  (hidden comment: Capacitor)
C14  value 0.1u  Voltage: 16V  [0603_CAP]  (hidden comment: Capacitor)
C15  value 0.1u  Voltage: 16V  [0603_CAP]  (hidden comment: Capacitor)
TP19  1mm Testpoint  [1mm_testpoint]  (value not drawn)
TP20  1mm Testpoint  [1mm_testpoint]  (value not drawn)
TP21  1mm Testpoint  [1mm_testpoint]  (value not drawn)
TP22  1mm Testpoint  [1mm_testpoint]  (value not drawn)
U2  TMP235A4DCKR  [SOT23-3]
U3  TMP235A4DCKR  [SOT23-3]
U4  TMP235A4DCKR  [SOT23-3]
U5  TMP235A4DCKR  [SOT23-3]

### Ports
GND, TEMP1 (out), TEMP2 (out), TEMP3 (out), TEMP4 (out), VDD (in)

### Nets
GND: C12.1 C13.1 C14.1 C15.1 U2.3(GND) U3.3(GND) U4.3(GND) U5.3(GND) ; port GND  [project net DGND]
VDD: C12.2 C13.2 C14.2 C15.2 U2.1(VDD) U3.1(VDD) U4.1(VDD) U5.1(VDD) ; port VDD  [project net 3V3_PWR]
ADC1_IN10: TP19.1 U2.2(Vout) ; port TEMP1
ADC1_IN11: TP21.1 U4.2(Vout) ; port TEMP3
ADC1_IN14: TP20.1 U3.2(Vout) ; port TEMP2
ADC1_IN15: TP22.1 U5.2(Vout) ; port TEMP4

### Library data of the parts
TP19-TP22 = 1mm Testpoint: 1mm test point; ComponentLink1Description: Digikey; ComponentLink1URL: https://www.digikey.com/product-detail/en/te-connectivity-amp-connectors/RCU-0C/A106145CT-ND/3477802
U2-U5 = TMP235A4DCKR: Temperature Sensor Analog, Local -40°C ~ 150°C 10mV/°C SOT-23-3; ComponentLink1Description: Digikey; ComponentLink1URL: https://www.digikey.com/en/products/detail/texas-instruments/TMP235A4DBZR/9649794
C12-C15 = Capacitor: Dielectric: *; Percent Tolerance: *; ESR: *

## Sheet High_Current_Sense.SchDoc
size A; SheetNumber: 12; SheetTotal: 16
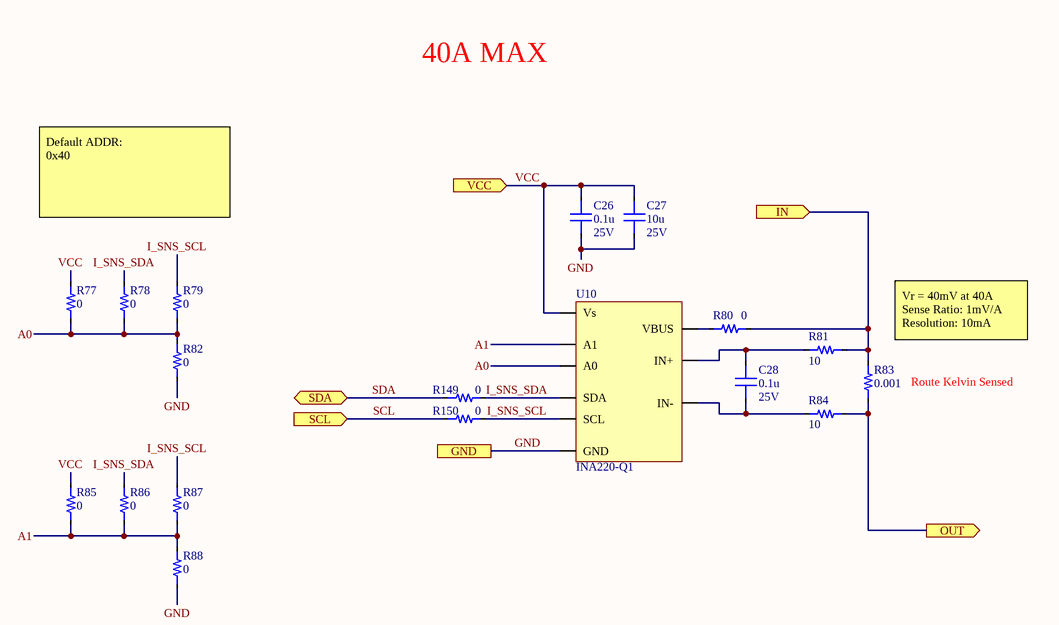
[diagram p5: High_Current_Sense.SchDoc]

### Parts
C26  value 0.1u  Voltage: 25V  [0603_CAP]  (hidden comment: Capacitor)
C27  value 10u  Voltage: 25V  [0805_CAP]  (hidden comment: Capacitor)
C28  value 0.1u  Voltage: 25V  [0603_CAP]  (hidden comment: Capacitor)
R77  value 0  [0603_RES]  (hidden comment: Resistor)
R78  value 0  [0603_RES]  (hidden comment: Resistor)
R79  value 0  [0603_RES]  (hidden comment: Resistor)
R80  value 0  [0603_RES]  (hidden comment: Resistor)
R81  value 10  [0603_RES]  (hidden comment: Resistor)
R82  value 0  [0603_RES]  (hidden comment: Resistor)
R83  value 0.001  [2512_RES]  (hidden comment: Resistor)
R84  value 10  [0603_RES]  (hidden comment: Resistor)
R85  value 0  [0603_RES]  (hidden comment: Resistor)
R86  value 0  [0603_RES]  (hidden comment: Resistor)
R87  value 0  [0603_RES]  (hidden comment: Resistor)
R88  value 0  [0603_RES]  (hidden comment: Resistor)
R149  value 0  [0603_RES]  (hidden comment: Resistor)
R150  value 0  [0603_RES]  (hidden comment: Resistor)
U10  INA220-Q1  [TSSOP-10]

### Ports
GND, IN (in), OUT (out), SCL (in), SDA (bidir), VCC (in)

### Nets
12V_PWR: R83.1 R84.2 ; port OUT
GND: C26.1 C27.1 R82.1 R88.1 U10.7(GND) ; port GND  [project net DGND]
VCC: C26.2 C27.2 R77.2 R85.2 U10.6(Vs) ; port VCC  [project net 3V3_PWR]
12V_ATX: R80.2 R81.2 R83.2 ; port IN
A0: R77.1 R78.1 R79.1 R82.2 U10.2(A0)
A1: R85.1 R86.1 R87.1 R88.2 U10.1(A1)
I_SNS_SCL: R79.2 R87.2 R150.2 U10.5(SCL)
I_SNS_SDA: R78.2 R86.2 R149.2 U10.4(SDA)
SCL: R150.1 ; port SCL  [project net ONBOARD_I2C_SCL]
SDA: R149.1 ; port SDA  [project net ONBOARD_I2C_SDA]
NetC28_1: C28.1 R84.1 U10.9(IN-)
NetC28_2: C28.2 R81.1 U10.10(IN+)
NetR80_1: R80.1 U10.8(VBUS)

### Notes on the sheet
- 40A MAX
- Default ADDR:
  0x40
- Vr = 40mV at 40A
  Sense Ratio: 1mV/A
  Resolution: 10mA
- (near R83) Route Kelvin Sensed

### Library data of the parts
R83 = Resistor: Tolerance: 1%; Power: 2
U10 = INA220-Q1: Current Monitor Regulator High/Low-Side 10mA 10-VSSOP; Name: INA220-Q1; ComponentLink1Description: Datasheet; ComponentLink1URL: https://www.analog.com/media/en/technical-documentation/data-sheets/6100fd.pdf; ComponentLink2Description: Digikey; ComponentLink2URL: https://www.digikey.com/product-detail/en/linear-technology-analog-devices/LT6100CMS8-TRPBF/LT6100CMS8-TRPBFCT-ND/7917234
C26-C28 = Capacitor: Dielectric: *; Percent Tolerance: *; ESR: *
R77-R82 R84-R88 R149 R150 = Resistor: Tolerance: *

## Sheet ATX_Interface.SchDoc
size A; SheetNumber: 2; SheetTotal: 16
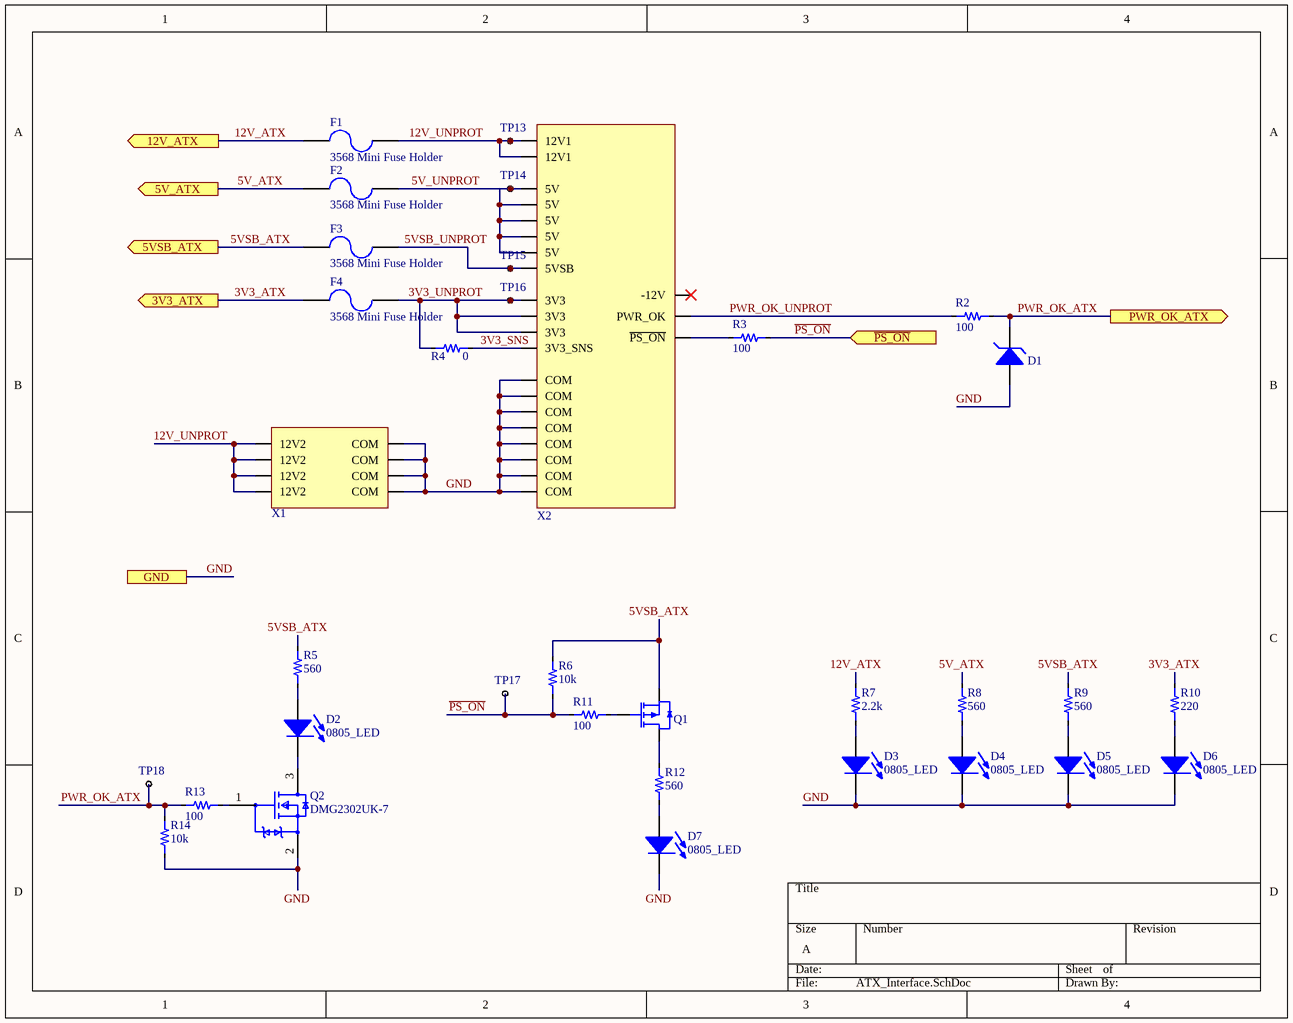
[diagram p6: ATX_Interface.SchDoc]

### Parts
D1  SZMMSZ5227BT1G  [SOD-123]  (value not drawn)
D2  0805_LED  [0805_LED]
D3  0805_LED  [0805_LED]
D4  0805_LED  [0805_LED]
D5  0805_LED  [0805_LED]
D6  0805_LED  [0805_LED]
D7  0805_LED  [0805_LED]
F1  3568 Mini Fuse Holder  [3568MiniFuseHolder]
F2  3568 Mini Fuse Holder  [3568MiniFuseHolder]
F3  3568 Mini Fuse Holder  [3568MiniFuseHolder]
F4  3568 Mini Fuse Holder  [3568MiniFuseHolder]
Q1  MOSFET P-CH 30V 2A SOT-23  [SOT23-3]  (value not drawn)
Q2  DMG2302UK-7  [SOT23-3]
R2  value 100  [0603_RES]  (hidden comment: Resistor)
R3  value 100  [0603_RES]  (hidden comment: Resistor)
R4  value 0  [0603_RES]  (hidden comment: Resistor)
R5  value 560  [0603_RES]  (hidden comment: Resistor)
R6  value 10k  [0603_RES]  (hidden comment: Resistor)
R7  value 2.2k  [0603_RES]  (hidden comment: Resistor)
R8  value 560  [0603_RES]  (hidden comment: Resistor)
R9  value 560  [0603_RES]  (hidden comment: Resistor)
R10  value 220  [0603_RES]  (hidden comment: Resistor)
R11  value 100  [0603_RES]  (hidden comment: Resistor)
R12  value 560  [0603_RES]  (hidden comment: Resistor)
R13  value 100  [0603_RES]  (hidden comment: Resistor)
R14  value 10k  [0603_RES]  (hidden comment: Resistor)
TP13  1mm Testpoint  [1mm_testpoint]  (value not drawn)
TP14  1mm Testpoint  [1mm_testpoint]  (value not drawn)
TP15  1mm Testpoint  [1mm_testpoint]  (value not drawn)
TP16  1mm Testpoint  [1mm_testpoint]  (value not drawn)
TP17  1mm Testpoint  [1mm_testpoint]  (value not drawn)
TP18  1mm Testpoint  [1mm_testpoint]  (value not drawn)
X1  ATX 8 Pin Aux Power  [MOLEX 039299042]  (value not drawn)
X2  ATX 24 Pin Main Power  [MOLEX 44206-000X]  (value not drawn)

### Ports
3V3_ATX (out), 5V_ATX (out), 5VSB_ATX (out), 12V_ATX (out), GND, PWR_OK_ATX (out), ~{PS_ON} (in)

### Nets
5VSB_ATX: F3.1 Q1.2(S) R5.2 R6.2 R9.2 ; port 5VSB_ATX
GND: D1.2(A) D3.2(K) D4.2(K) D5.2(K) D6.2(K) D7.2(K) Q2.2(S) R14.2 X1.1(COM) X1.2(COM) X1.3(COM) X1.4(COM) X2.3(COM) X2.5(COM) X2.7(COM) X2.15(COM) X2.17(COM) X2.18(COM) X2.19(COM) X2.24(COM) ; port GND  [project net DGND]
3V3_ATX: F4.1 R10.2 ; port 3V3_ATX
3V3_SNS: R4.2 X2.13(3V3_SNS)
3V3_UNPROT: F4.2 R4.1 TP16.1 X2.1(3V3) X2.2(3V3) X2.12(3V3)
5V_ATX: F2.1 R8.2 ; port 5V_ATX
5V_UNPROT: F2.2 TP14.1 X2.4(5V) X2.6(5V) X2.21(5V) X2.22(5V) X2.23(5V)
5VSB_UNPROT: F3.2 TP15.1 X2.9(5VSB)
12V_ATX: F1.1 R7.2 ; port 12V_ATX
12V_UNPROT: F1.2 TP13.1 X1.5(12V2) X1.6(12V2) X1.7(12V2) X1.8(12V2) X2.10(12V1) X2.11(12V1)
~{PS_ON}: R3.1 R6.1 R11.2 TP17.1 ; port ~{PS_ON}
PWR_OK_ATX: D1.1(K) R2.1 R13.2 R14.1 TP18.1 ; port PWR_OK_ATX
PWR_OK_UNPROT: R2.2 X2.8(PWR_OK)
NetD2_1: D2.1(A) R5.1
NetD2_2: D2.2(K) Q2.3(D)
NetD3_1: D3.1(A) R7.1
NetD4_1: D4.1(A) R8.1
NetD5_1: D5.1(A) R9.1
NetD6_1: D6.1(A) R10.1
NetD7_1: D7.1(A) R12.1
NetQ1_1: Q1.1(G) R11.1
NetQ1_3: Q1.3(D) R12.2
NetQ2_1: Q2.1(G) R13.1
NetR3_2: R3.2 X2.16(~{PS_ON})

Not connected (* = marked no-connect by the designer): X2 14(-12V)*

### Library data of the parts
D1 = SZMMSZ5227BT1G: Zener Diode 3.6 V 500 mW ±5% Surface Mount SOD-123; Vr: 3.6; Num_Circuits: 1; Package: SOD-123; ComponentLink1Description: Digikey; ComponentLink1URL: https://www.digikey.com/en/products/detail/onsemi/SZMMSZ5227BT1G/3063346
D2-D7 = 0805_LED: Generic 0805 LED; Color: Green
F1-F4 = 3568 Mini Fuse Holder: Fuse Holder 30A 500V 1 Circuit Blade Through Hole; ComponentLink1Description: Digikey; ComponentLink1URL: https://www.digikey.com/product-detail/en/keystone-electronics/3568/36-3568-ND/2137306; Max Current: 30A; Max Voltage: 500V
Q1 = STR2P3LLH6: P-Channel 2A (Ta) 350mW (Tc) Surface Mount SOT-23; Type: P Channel; VdsMax: 30; Num_Circuits: 1; Current: 2; RdsOn: 56; Vt: 10; VgsMax: 20; Package: SOT-23; ComponentLink1Description: Digikey; ComponentLink1URL: https://www.digikey.com/en/products/detail/stmicroelectronics/STR2P3LLH6/5244876; ComponentLink2Description: Datasheet; ComponentLink2URL: https://www.st.com/content/ccc/resource/technical/document/datasheet/96/4a/55/9d/3c/16/47/d6/DM00084050.pdf/files/DM00084050.pdf/jcr:content/translations/en.DM00084050.pdf
Q2 = DMG2302UK-7: MOSFET N-CH 20V 2.8A SOT23; Manufacturer: Diodes Inc.; Reverse Recovery Time: 5.3ns; Gate Charge At Vgs: 2.8nC @ 10V; Turn On Delay Time: 0.6ns; Pulse Drain Current: 12A; Max Forward Diode Voltage: 1.2V; Reverse Recovery Charge: 0.5nC; Automotive Grade: Grade 0; Threshold Vgs Min: 0.3V; Number Of N Channels: 1; Standoff Height: 0.013mm; Typ Forward Diode Voltage: 0.7V; Drain To Source Resistance: 61mΩ; Rthja Max: 192°C/W; Max Junction Temp: +150°C; Input Capacitace At Vds: 130pF @ 10V; Threshold Vgs Max: 1V; Turn Off Delay Time: 4.2ns; Depletion Mode: False; Gate To Source Voltage: 12V; Power Dissipation: 0.66W; Device Class L1: Discrete Semiconductors; Footprint Url: https://www.diodes.com/assets/Package-Files/SOT23.pdf; Lead Free: Yes; Manufacturer Part Number: DMG2302UK-7; Temperature Range High: +150°C; Drain To Source Voltage: 20V; Category: Trans; Digikey Description: MOSFET N-CH 20V 2.8A SOT23; RoHS: TRUE; Device Class L2: Transistors; Height: 1.1mm; Automotive: Yes; Package: SOT23; Drain To Source Breakdown Voltage: 20V; Continuous Drain Current: 2.8A; ComponentLink2Description: Datasheet; Device Class L3: MOSFETs; Octopart: https://octopart.com/dmg2302uk-7-diodes+inc.-73850182; Temperature Range Low: -55°C; Temperature: -55°C to +150°C; Number Of Channels: 1; ComponentLink2URL: https://www.diodes.com/assets/Datasheets/DMG2302UK.pdf
TP13-TP18 = 1mm Testpoint: 1mm test point; ComponentLink1Description: Digikey; ComponentLink1URL: https://www.digikey.com/product-detail/en/te-connectivity-amp-connectors/RCU-0C/A106145CT-ND/3477802
X1 = ATX 8 Pin Aux Power: ATX Aux Power 8 Pin Connector; MfrPartNo: 0039299082; ComponentLink1Description: Digikey; ComponentLink1URL: https://www.digikey.com/en/products/detail/molex/0039299082/1624283
X2 = ATX 24 Pin Main Power: ATX Main Power 24 Pin Connector; MfrPartNo: 0442060007; ComponentLink1Description: Digikey; ComponentLink1URL: https://www.digikey.com/en/products/detail/molex/0442060007/3311018
R2-R14 = Resistor: Tolerance: *

## Sheet EEPROM.SchDoc
size A; SheetNumber: 11; SheetTotal: 16
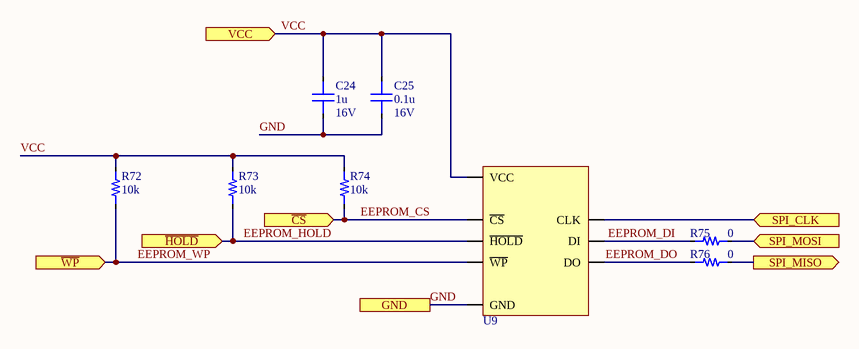
[diagram p7: EEPROM.SchDoc]

### Parts
C24  value 1u  Voltage: 16V  [0603_CAP]  (hidden comment: Capacitor)
C25  value 0.1u  Voltage: 16V  [0603_CAP]  (hidden comment: Capacitor)
R72  value 10k  [0603_RES]  (hidden comment: Resistor)
R73  value 10k  [0603_RES]  (hidden comment: Resistor)
R74  value 10k  [0603_RES]  (hidden comment: Resistor)
R75  value 0  [0603_RES]  (hidden comment: Resistor)
R76  value 0  [0603_RES]  (hidden comment: Resistor)
U9  W25X40CL  [SOIC-8]  (value not drawn)

### Ports
GND, SPI_CLK (in), SPI_MISO (out), SPI_MOSI (in), VCC (in), ~{CS} (in), ~{HOLD} (in), ~{WP} (in)

### Nets
GND: C24.1 C25.1 U9.4(GND) ; port GND  [project net DGND]
VCC: C24.2 C25.2 R72.2 R73.2 R74.2 U9.8(VCC) ; port VCC
EEPROM_CS: R74.1 U9.1(~{CS}) ; port ~{CS}
EEPROM_DI: R75.1 U9.5(DI)
EEPROM_DO: R76.1 U9.2(DO)
EEPROM_HOLD: R73.1 U9.7(~{HOLD}) ; port ~{HOLD}
EEPROM_WP: R72.1 U9.3(~{WP}) ; port ~{WP}
SPI_INT_MISO: R76.2 ; port SPI_MISO
SPI_INT_MOSI: R75.2 ; port SPI_MOSI
SPI_INT_SCK: U9.6(CLK) ; port SPI_CLK

### Library data of the parts
U9 = W25X40CL: FLASH Memory IC 4Mbit SPI 104 MHz 8-SOIC; Num_Circuits: 1; Voltage: 5; ComponentLink1Description: Digikey; ComponentLink1URL: https://www.digikey.com/en/products/detail/winbond-electronics/W25X40CLSNIG/3008652
C24 C25 = Capacitor: Dielectric: *; Percent Tolerance: *; ESR: *
R72-R76 = Resistor: Tolerance: *

## Sheet Card_Interface.SchDoc
size A; SheetNumber: 10; SheetTotal: 16
Used 4 times, as channels U_Card_Interface, U_Card_Interface, U_Card_Interface, U_Card_Interface. Parts and nets are listed once, with the designators drawn on the sheet.
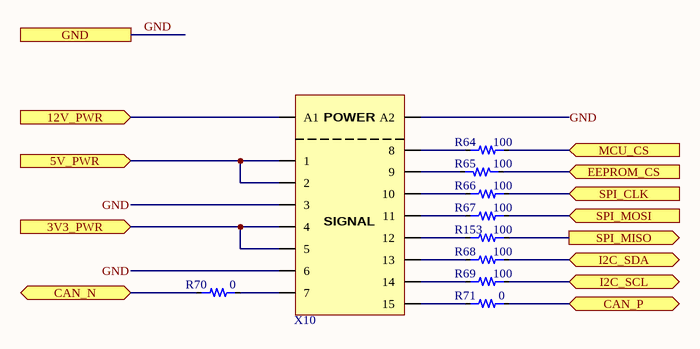
[diagram p8: Card_Interface.SchDoc]

### Parts
R64  value 100  [0603_RES]  (hidden comment: Resistor)
R65  value 100  [0603_RES]  (hidden comment: Resistor)
R66  value 100  [0603_RES]  (hidden comment: Resistor)
R67  value 100  [0603_RES]  (hidden comment: Resistor)
R68  value 100  [0603_RES]  (hidden comment: Resistor)
R69  value 100  [0603_RES]  (hidden comment: Resistor)
R70  value 0  [0603_RES]  (hidden comment: Resistor)
R71  value 0  [0603_RES]  (hidden comment: Resistor)
R153  value 100  [0603_RES]  (hidden comment: Resistor)
X10  681M17W2203L  [681M17W2203L]  (value not drawn)

### Ports
3V3_PWR (in), 5V_PWR (in), 12V_PWR (in), CAN_N (bidir), CAN_P (bidir), EEPROM_CS (in), GND, I2C_SCL (bidir), I2C_SDA (bidir), MCU_CS (in), SPI_CLK (in), SPI_MISO (out), SPI_MOSI (in)

### Nets
3V3_PWR: X10.4 X10.5 ; port 3V3_PWR
5V_PWR: X10.1 X10.2 ; port 5V_PWR
12V_PWR: X10.A1 ; port 12V_PWR
CAN_N: R70.1 ; port CAN_N
CAN_P: R71.1 ; port CAN_P
EEPROM_CS: R65.2 ; port EEPROM_CS
GND: X10.3 X10.6 X10.A2 ; port GND
I2C_SCL: R69.1 ; port I2C_SCL
I2C_SDA: R68.1 ; port I2C_SDA
MCU_CS: R64.1 ; port MCU_CS
SPI_CLK: R66.1 ; port SPI_CLK
SPI_MISO: R153.1 ; port SPI_MISO
SPI_MOSI: R67.1 ; port SPI_MOSI
NetR64_2: R64.2 X10.8
NetR65_1: R65.1 X10.9
NetR66_2: R66.2 X10.10
NetR67_2: R67.2 X10.11
NetR68_2: R68.2 X10.13
NetR69_2: R69.2 X10.14
NetR70_2: R70.2 X10.7
NetR71_2: R71.2 X10.15
NetR153_2: R153.2 X10.12

### Channels
U_Card_Interface: designators end in _U_Card_Interface#1; ports 3V3_PWR=3V3_OUT_0 5V_PWR=5V_OUT_0 12V_PWR=12V_OUT_1 CAN_N=CAN_N CAN_P=CAN_P EEPROM_CS=SPI_CS_BRD1_1 GND=DGND I2C_SCL=I2C_EXT_SCL I2C_SDA=I2C_EXT_SDA MCU_CS=SPI_CS_BRD1_2 SPI_CLK=SPI_EXT_SCK SPI_MISO=SPI_EXT_MISO SPI_MOSI=SPI_EXT_MOSI
U_Card_Interface: designators end in _U_Card_Interface#2; ports 3V3_PWR=3V3_OUT_1 5V_PWR=5V_OUT_1 12V_PWR=12V_OUT_2 CAN_N=CAN_N CAN_P=CAN_P EEPROM_CS=SPI_CS_BRD2_1 GND=DGND I2C_SCL=I2C_EXT_SCL I2C_SDA=I2C_EXT_SDA MCU_CS=SPI_CS_BRD2_2 SPI_CLK=SPI_EXT_SCK SPI_MISO=SPI_EXT_MISO SPI_MOSI=SPI_EXT_MOSI
U_Card_Interface: designators end in _U_Card_Interface#3; ports 3V3_PWR=3V3_OUT_0 5V_PWR=5V_OUT_0 12V_PWR=12V_OUT_1 CAN_N=CAN_N CAN_P=CAN_P EEPROM_CS=SPI_CS_BRD3_1 GND=DGND I2C_SCL=I2C_EXT_SCL I2C_SDA=I2C_EXT_SDA MCU_CS=SPI_CS_BRD3_2 SPI_CLK=SPI_EXT_SCK SPI_MISO=SPI_EXT_MISO SPI_MOSI=SPI_EXT_MOSI
U_Card_Interface: designators end in _U_Card_Interface#4; ports 3V3_PWR=3V3_OUT_1 5V_PWR=5V_OUT_1 12V_PWR=12V_OUT_2 CAN_N=CAN_N CAN_P=CAN_P EEPROM_CS=SPI_CS_BRD4_1 GND=DGND I2C_SCL=I2C_EXT_SCL I2C_SDA=I2C_EXT_SDA MCU_CS=SPI_CS_BRD4_2 SPI_CLK=SPI_EXT_SCK SPI_MISO=SPI_EXT_MISO SPI_MOSI=SPI_EXT_MOSI

### Notes on the sheet
- (in symbol 681M17W2203L) POWER; SIGNAL

### Library data of the parts
X10 = 681M17W2203L: 17 (15 + 2 Power) Position D-Sub, Combo Receptacle, Female Sockets Connector; Circuits: 17; Name: 681M17W2203L; ComponentLink1Description: Digikey; ComponentLink1URL: https://www.digikey.com/en/products/detail/norcomp-inc/681M17W2203L001/4311857
R64-R71 R153 = Resistor: Tolerance: *